# Altium schematic sheet Connectors and Headers.SchDoc
size A4; SheetNumber: 3; SheetTotal: 3
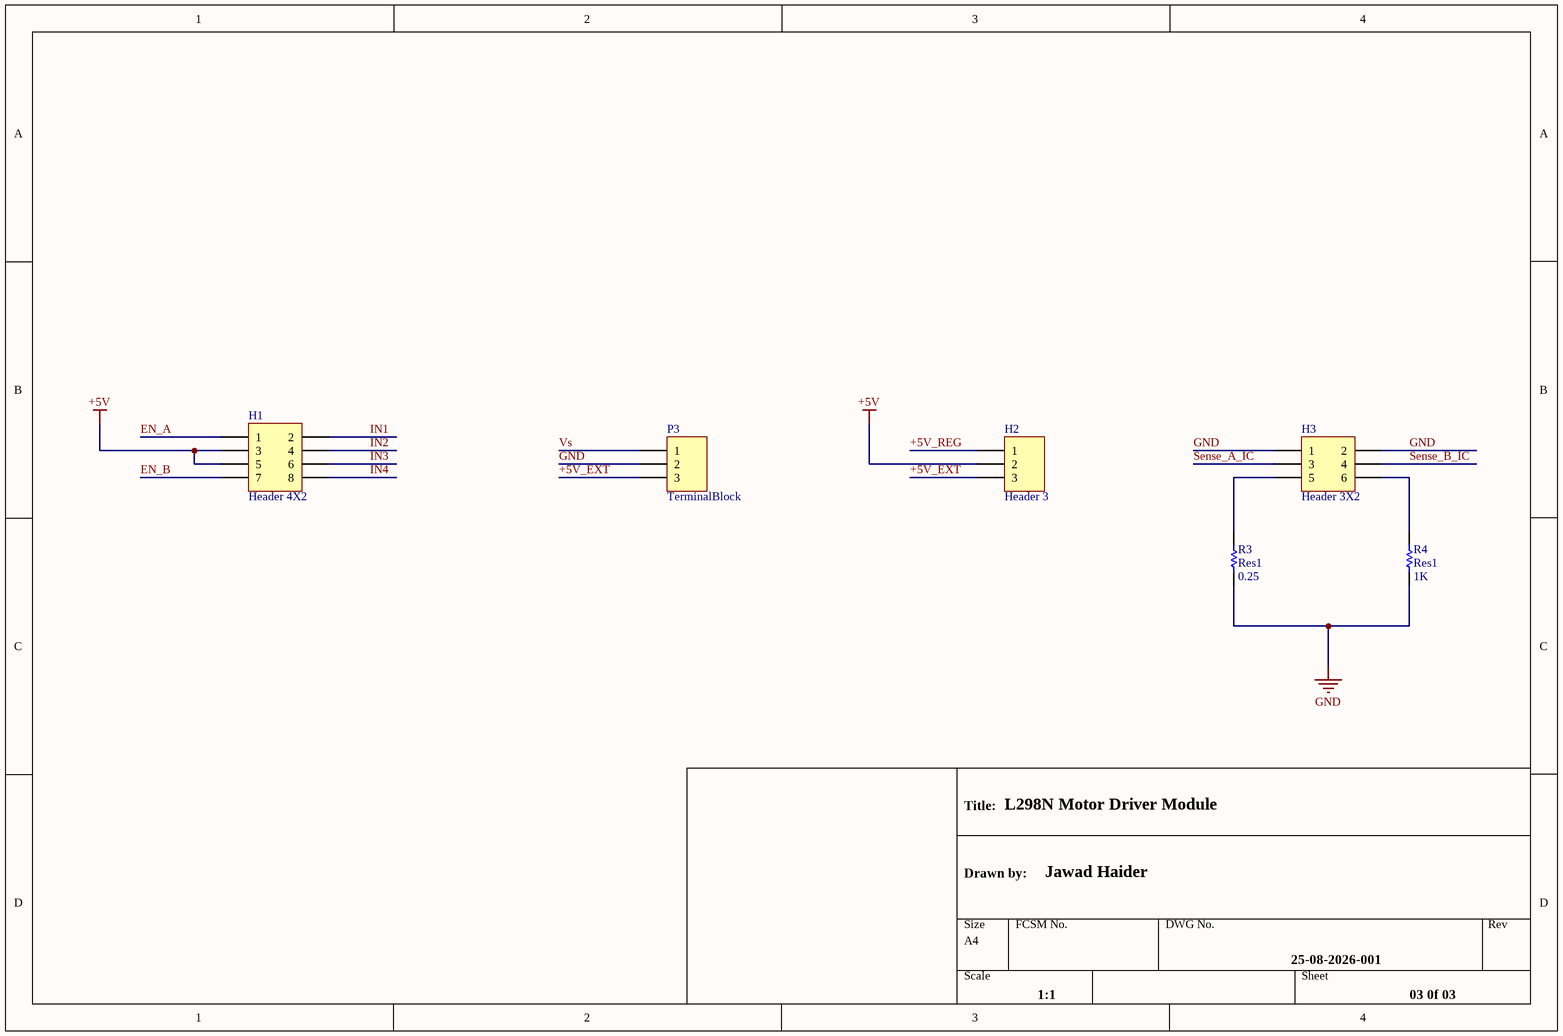
[diagram p0: Connectors and Headers.SchDoc]

## Parts
H1  Header 4X2  [Header 2x4 2.54mm]
H2  Header 3  [Header_1x3_2.54mm]
H3  Header 3X2  [Header 2x3 2.54mm]
P3  TerminalBlock  [TERMINAL BLOCK 3 PIN 5.08MM]
R3  Res1  value 0.25  [RES_1206]
R4  Res1  value 1K  [RES_1206]

## Nets
+5V: H1.3 H1.5 H2.2
GND: H3.1 H3.2 P3.2 R3.1 R4.1
+5V_EXT: H2.3 P3.3
+5V_REG: H2.1
EN_A: H1.1
EN_B: H1.7
IN1: H1.2
IN2: H1.4
IN3: H1.6
IN4: H1.8
Sense_A_IC: H3.3
Sense_B_IC: H3.4
Vs: P3.1
NetH3_5: H3.5 R3.2
NetH3_6: H3.6 R4.2

## Notes on the sheet
- Title:
- L298N Motor Driver Module
- Drawn by:
- Jawad Haider
- 25-08-2026-001
- 1:1
- 03 0f 03

## Library data of the parts
H1 = Header 4X2: Header, 4-Pin, Dual row; LatestRevisionDate: 17-Jul-2002; LatestRevisionNote: Re-released for DXP Platform.; Publisher: Altium Limited
H2 P3 = Header 3: Header, 3-Pin; LatestRevisionDate: 17-Jul-2002; LatestRevisionNote: Re-released for DXP Platform.; Publisher: Altium Limited
H3 = Header 3X2: Header, 3-Pin, Dual row; LatestRevisionDate: 17-Jul-2002; LatestRevisionNote: Re-released for DXP Platform.; Publisher: Altium Limited
R3 R4 = Res1: Resistor; Published: 8-Jun-2000; LatestRevisionDate: 17-Jul-2002; LatestRevisionNote: Re-released for DXP Platform.; PackageReference: AXIAL-0.3; Publisher: Altium Limited; PackageDescription: Axial Device, Thru-Hole; 2 Leads; 0.3 in Pin Spacing